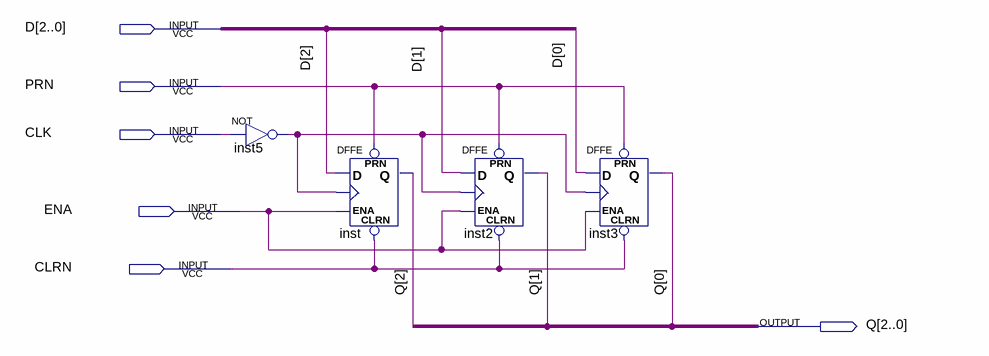
[diagram p0: schematic sheet]
// Quartus schematic recoder_3.bdf as structural Verilog: 4 symbols, 6 pins
module recoder_3 (
  input  [2:0] D,
  input  PRN,
  input  CLK,
  input  ENA,
  input  CLRN,
  output [2:0] Q
);

  wire inst5_out;

  not inst5 (inst5_out, CLK);
  DFFE inst (.PRN(PRN), .CLRN(CLRN), .D(D[2]), .CLK(inst5_out), .ENA(ENA), .Q(Q[2]));
  DFFE inst2 (.PRN(PRN), .CLRN(CLRN), .D(D[1]), .CLK(inst5_out), .ENA(ENA), .Q(Q[1]));
  DFFE inst3 (.PRN(PRN), .CLRN(CLRN), .D(D[0]), .CLK(inst5_out), .ENA(ENA), .Q(Q[0]));
endmodule
